# EAGLE design FluxamasynthFeather (EAGLE 8.4.1)
ABBREV: Flux3; AUTHOR: Nadya B.; PROJECT: Fluxamasynth 3
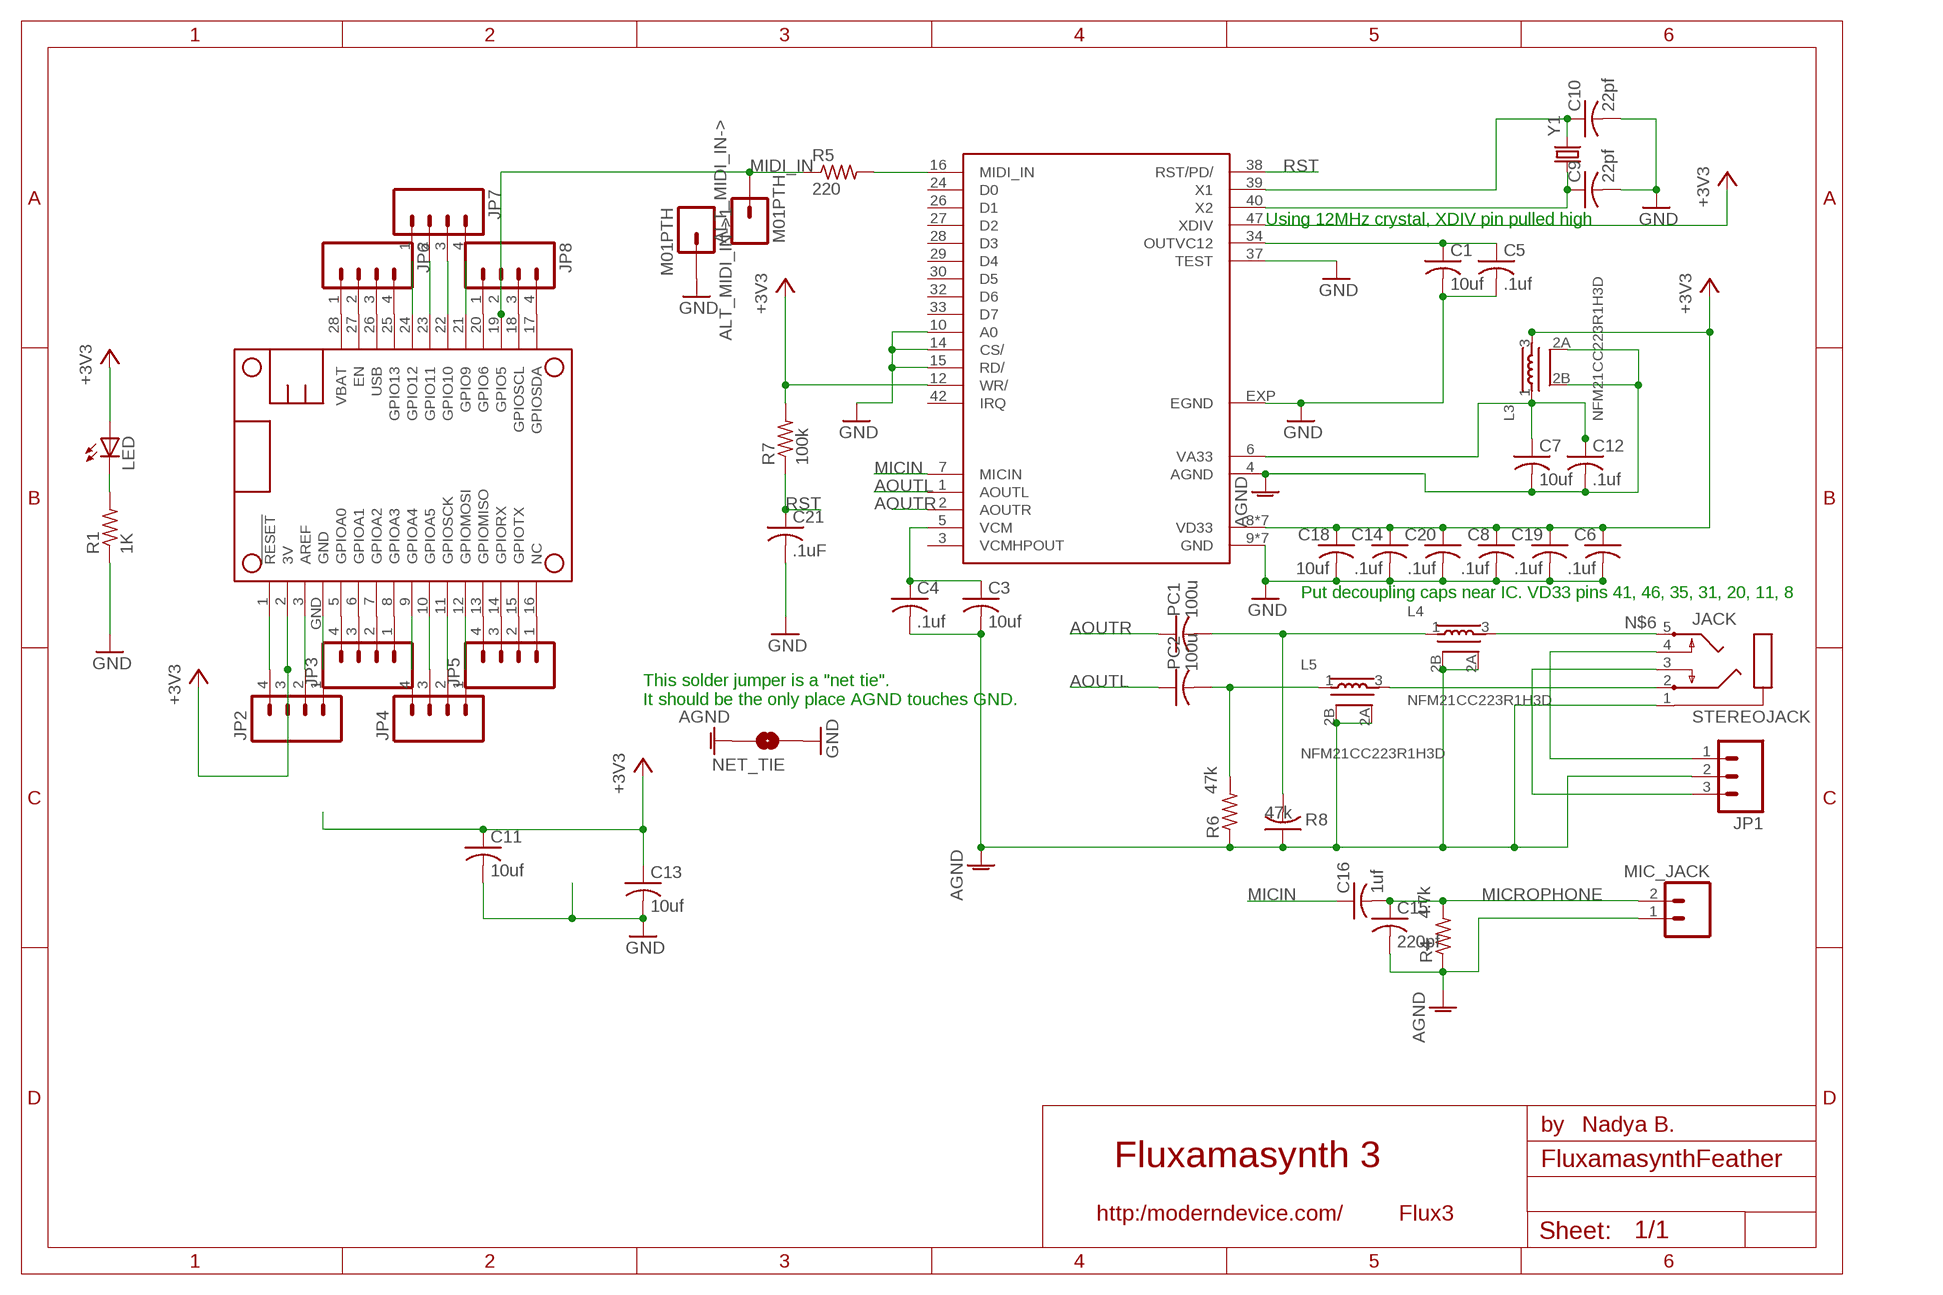
[diagram p0: schematic, sheet 1]

## Parts
ALT_MIDI_IN->  M01PTH  [1X01]
ALT_MIDI_IN->1  M01PTH  [1X01]
C1  10uf  C-USC0805K  [C0805K]
C3  10uf  C-USC0805K  [C0805K]
C4  .1uf  C-USC0603K  [C0603K]
C5  .1uf  C-USC0603K  [C0603K]
C6  .1uf  C-USC0603K  [C0603K]
C7  10uf  C-USC0805K  [C0805K]
C8  .1uf  C-USC0603K  [C0603K]
C9  22pf  C-USC0603  [C0603]
C10  22pf  C-USC0603  [C0603]
C11  10uf  C-USC0805K  [C0805K]
C12  .1uf  C-USC0603K  [C0603K]
C13  10uf  C-USC0805K  [C0805K]
C14  .1uf  C-USC0603K  [C0603K]
C15  220pf  C-USC0805K  [C0805K]
C16  1uf  C-USC0603K  [C0603K]
C18  10uf  C-USC0603K  [C0603K]
C19  .1uf  C-USC0603K  [C0603K]
C20  .1uf  C-USC0603K  [C0603K]
C21  .1uF  C-USC0603K  [C0603K]
JACK  STEREOJACK  [STX3100]
JP1  M03PTH  [1X03]
JP2  M041X04_NO_SILK  [1X04_NO_SILK]
JP3  M041X04_NO_SILK  [1X04_NO_SILK]
JP4  M041X04_NO_SILK  [1X04_NO_SILK]
JP5  M041X04_NO_SILK  [1X04_NO_SILK]
JP6  M041X04_NO_SILK  [1X04_NO_SILK]
JP7  M041X04_NO_SILK  [1X04_NO_SILK]
JP8  M041X04_NO_SILK  [1X04_NO_SILK]
L3  NFM21CC223R1H3D  [3PC]
L4  NFM21CC223R1H3D  [3PC]
L5  NFM21CC223R1H3D  [3PC]
LED  LED0603  [LED-0603]
MIC_JACK  M02PTH  [1X02]
MS1  FEATHERWING  [FEATHERWING]
NET_TIE  MODERNDEVICE_SOLDERJUMPERTRACE  [MODERNDEVICE_SJ_2S-TRACE]
PC1  100u  C-USC1206K  [C1206K]
PC2  100u  C-USC1206K  [C1206K]
R1  1K  R-US_R0603  [R0603]
R4  4.7k  R-US_R0603  [R0603]
R5  220  R-US_R0603  [R0603]
R6  47k  R-US_R0603  [R0603]
R7  100k  R-US_R0603  [R0603]
R8  47k  C-USC0603K  [C0603K]
SAM2695  SAM2695  [QFN48]
Y1  CRYSTALTXC-7A  [CRYSTAL-TXC-7A]

## Nets
+3V3 [VCC]: C6.1 C8.1 C11.1 C13.1 C14.1 C18.1 C19.1 C20.1 JP2.3 L3.3 LED.A MS1.2(3V) R7.2 SAM2695.8(VD33) SAM2695.11(VD33) SAM2695.12(WR/) SAM2695.20(VD33) SAM2695.31(VD33) SAM2695.35(VD33) SAM2695.41(VD33) SAM2695.46(VD33) SAM2695.47(XDIV)
AGND [GND]: C3.2 C4.2 C7.2 C12.2 C15.2 JACK.1 JP1.2 L3.2A L3.2B L4.2A L4.2B L5.2A L5.2B MIC_JACK.1 NET_TIE.2 R4.1 R6.1 R8.1 SAM2695.4(AGND)
AOUTL: PC2.1 SAM2695.1(AOUTL)
AOUTR: PC1.1 SAM2695.2(AOUTR)
GND [GND]: ALT_MIDI_IN->1.1 C1.2 C5.2 C6.2 C8.2 C9.2 C10.2 C11.2 C13.2 C14.2 C18.2 C19.2 C20.2 C21.2 NET_TIE.1 R1.1 SAM2695.9(GND) SAM2695.10(A0) SAM2695.13(GND) SAM2695.14(CS/) SAM2695.15(RD/) SAM2695.18(GND) SAM2695.25(GND) SAM2695.36(GND) SAM2695.37(TEST) SAM2695.45(GND) SAM2695.48(GND) SAM2695.EXP(EGND)
MICIN: C16.1 SAM2695.7(MICIN)
MICROPHONE: C15.1 C16.2 MIC_JACK.2 R4.2
MIDI_IN: ALT_MIDI_IN->.1 JP8.2 MS1.19(GPIO5) R5.1
N$1: JP2.1 MS1.GND
N$2: JP2.2 MS1.3(AREF)
N$3: JP2.4 MS1.1(!RESET)
N$4: JP3.1 MS1.8(GPIOA3)
N$5: L5.1 PC2.2 R6.2
N$6: JACK.5 L4.3
N$7: JP3.2 MS1.7(GPIOA2)
N$8: JP3.3 MS1.6(GPIOA1)
N$9: LED.C R1.2
N$10: JP3.4 MS1.5(GPIOA0)
N$11: JP4.1 MS1.12(GPIOMOSI)
N$12: R5.2 SAM2695.16(MIDI_IN)
N$13: JP4.2 MS1.11(GPIOSCK)
N$14: JP4.3 MS1.10(GPIOA5)
N$15: JP4.4 MS1.9(GPIOA4)
N$16: JP5.1 MS1.16(NC)
N$17: JP5.2 MS1.15(GPIOTX)
N$18: JP5.3 MS1.14(GPIORX)
N$19: JP5.4 MS1.13(GPIOMISO)
N$20: JP6.2 MS1.27(EN)
N$21: JACK.4 JP1.1
N$22: JP6.4 MS1.25(GPIO13)
N$23: JP7.1 MS1.24(GPIO12)
N$24: JACK.3 JP1.3
N$25: JP7.2 MS1.23(GPIO11)
N$26: JP7.3 MS1.22(GPIO10)
N$27: JP7.4 MS1.21(GPIO9)
N$28: JP8.1 MS1.20(GPIO6)
N$29: JP8.3 MS1.18(GPIOSCL)
N$30: JP8.4 MS1.17(GPIOSDA)
OUT_L: JACK.2 L5.3
OUT_R: L4.1 PC1.2 R8.2
OUTVC12: C1.1 C5.1 SAM2695.34(OUTVC12)
RST: C21.1 R7.1 SAM2695.38(RST/PD/)
USB: JP6.3 MS1.26(USB)
VA33 [VCC]: C7.1 C12.1 L3.1 SAM2695.6(VA33)
VBAT: JP6.1 MS1.28(VBAT)
VCM: C3.1 C4.1 SAM2695.5(VCM)
XTL1: C10.1 SAM2695.39(X1) Y1.P$2
XTL2: C9.1 SAM2695.40(X2) Y1.P$1
Unconnected: SAM2695.3(VCMHPOUT) SAM2695.24(D0) SAM2695.26(D1) SAM2695.27(D2) SAM2695.28(D3) SAM2695.29(D4) SAM2695.30(D5) SAM2695.32(D6) SAM2695.33(D7) SAM2695.42(IRQ)

## Notes on the sheet
- Using 12MHz crystal, XDIV pin pulled high
- Put decoupling caps near IC. VD33 pins 41, 46, 35, 31, 20, 11, 8
- This solder jumper is a "net tie".
  It should be the only place AGND touches GND.

## Library data of the parts
ALT_MIDI_IN-> ALT_MIDI_IN->1 = ModernDevice:M01: Header 1 Standard 1-pin 0.1" header. Use with straight break away headers (SKU : PRT-00116), right angle break away headers (PRT-00553), swiss pins (PRT-00743), machine pins (PRT-00117), and female headers (PRT-00115).
C1 C3-C16 C18-C21 PC1 PC2 R8 = ModernDevice:C-US: CAPACITOR, American symbol
JACK = ModernDevice:STEREOJACK: MIC/HEADPHONE JACK Stereo jack with two switches. Kycon STX3100, CUI SJ1-3555NG and/or 4UCon 05544
JP1 = ModernDevice:M03: Header 3 Standard 3-pin 0.1" header. Use with straight break away headers (SKU : PRT-00116), right angle break away headers (PRT-00553), swiss pins (PRT-00743), machine pins (PRT-00117), and female headers (PRT-00115). Molex polarized connector foot print use with SKU : PRT-08232 with associated crimp pins and housings.
JP2-JP8 = ModernDevice:M04: Header 4 Standard 4-pin 0.1" header. Use with straight break away headers (SKU : PRT-00116), right angle break away headers (PRT-00553), swiss pins (PRT-00743), machine pins (PRT-00117), and female headers (PRT-00115). Molex polarized connector foot print use with SKU : PRT-08231 with associated crimp pins and housings.
L3-L5 = ModernDevice:NFM21CC223R1H3D: CAPACITOR-TYPE NOISE SUPPRESSION FILTER digikey #NFM21CC223R1H3D
LED = ModernDevice:LED: LEDs Standard schematic elements and footprints for 5mm, 3mm, 1206, and 0603 sized LEDs. 5mm - Spark Fun Electronics SKU : COM-00529 (and others)
MIC_JACK = ModernDevice:M02: Header 2 Standard 2-pin 0.1" header. Use with straight break away headers (SKU : PRT-00116), right angle break away headers (PRT-00553), swiss pins (PRT-00743), machine pins (PRT-00117), and female headers (PRT-00115). Molex polarized connector foot print use with SKU : PRT-08233 with associated crimp pins and housings.
MS1 = adafruit:FEATHERWING
NET_TIE = BBLeo_v2:MODERNDEVICE_SOLDERJUMPER: Solder Jumper Standard SMD solder jumper. Used to automate production. Two varients : Normally Open and Normally Closed are the same, but have different paste layers. NC will have a large amount of paste and should jumper during reflow.
R1 R4-R7 = ModernDevice:R-US_: RESISTOR, American symbol
SAM2695 = ModernDevice:SAM2695
Y1 = SparkFun-FreqCtrl:CRYSTAL: Various standard crystals. Proven footprints. Spark Fun Electronics SKU : COM-00534

## Net classes
0 default: width 0.152 mm, drill 0.152 mm, clearance 0.152 mm
1 GND: width 0.152 mm, drill 0.152 mm, clearance 0.152 mm
2 VCC: width 0.152 mm, drill 0.152 mm, clearance 0.152 mm
3 VBUS: width 0.152 mm, drill 0.152 mm, clearance 0.152 mm

## Board
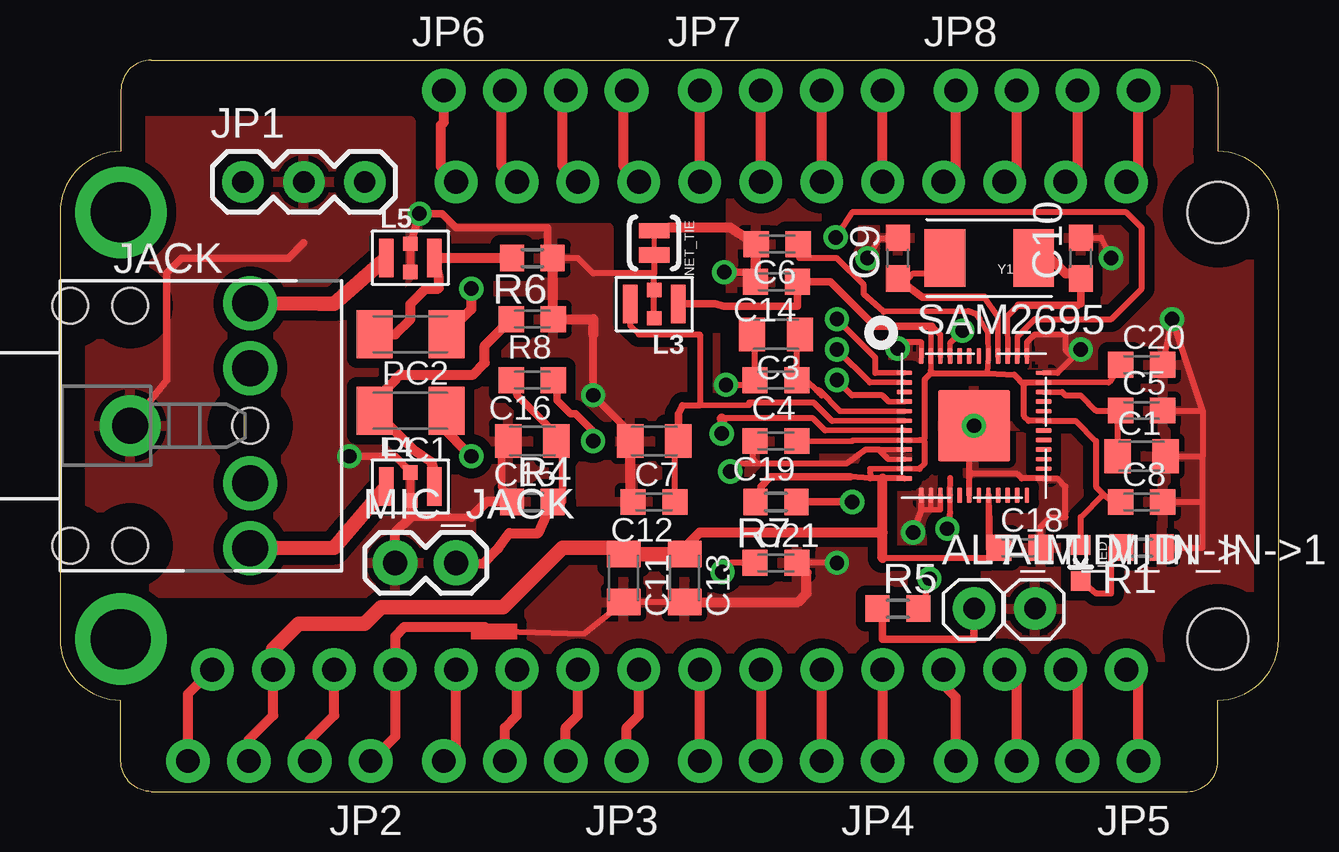
[diagram p1: board, top side]
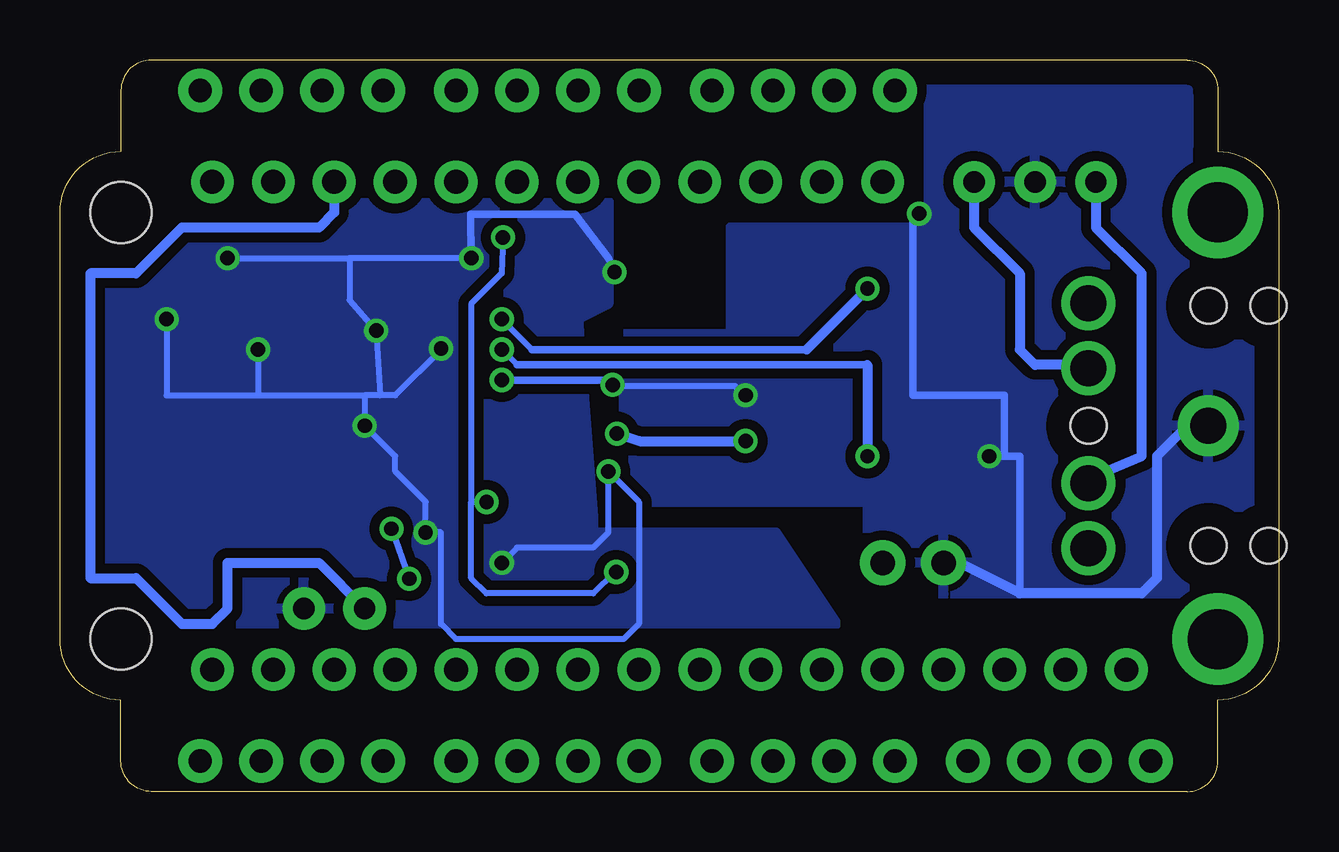
[diagram p2: board, bottom side, seen from below]

Size 50.8 x 30.48 mm. Coordinates in mm from the lower left corner, seen from the top.
Copper layers (1*16): Top 0.035mm / dielectric 1.5mm / Bottom 0.035mm
Design rules "default *": minimum track width 6mil, minimum drill 0.35mm, track to track 6mil, track to pad 6mil, pad to pad 6mil, via to via 6mil, smd to smd 6mil, copper to edge 40mil, drill to drill 6mil, minimum pad ring 10mil, minimum via ring 8mil, stop-mask expansion 4mil, vias tented up to drill 25mil, thermal gap 10mil

### Footprints (pad centres in the part's own frame; a part is rotated, then mirrored left to right if it is on the bottom)
1X01 = drill 0.889 pad 1.778: 1 0,0
C0805K = smd 1.1 x 1.4: 1 -1,0; 2 1,0
C0603K = smd 1.05 x 1.08: 1 -0.875,0; 2 0.875,0
C0603 = smd 1.1 x 1: 1 -0.85,0; 2 0.85,0
STX3100 = drill 1.5 pad 2.54: 1 2.929,0.002 | drill 1.5: 2 7.929,5.102; 3 7.929,2.402; 4 7.929,-2.398; 5 7.929,-5.098 | hole 1.5: 2.929,5.002; 2.929,-4.998; 7.929,0.002; 0.429,5.002; 0.429,-4.998
1X03 = drill 0.889 pad 1.727: 1 0,0; 2 2.54,0; 3 5.08,0
1X04_NO_SILK = drill 0.965 pad 1.829: 1 0,0; 2 2.54,0; 3 5.08,0; 4 7.62,0
3PC = smd 0.6 x 1.6: 1 0.998,0.013; 3 -1,0.01 | smd 0.6 x 0.6: 2A 0,-0.58; 2B 0,0.6
LED-0603 = smd 0.8 x 0.8: A 0,-0.75; C 0,0.75
1X02 = drill 1.016 pad 1.88: 1 0,0; 2 2.54,0
FEATHERWING = drill 1 pad 1.778: 1 6.35,1.27; 2 8.89,1.27; 3 11.43,1.27; 5 16.51,1.27; 6 19.05,1.27; 7 21.59,1.27; 8 24.13,1.27; 9 26.67,1.27; 10 29.21,1.27; 11 31.75,1.27; 12 34.29,1.27; 13 36.83,1.27; 14 39.37,1.27; 15 41.91,1.27; 16 44.45,1.27; 17 44.45,21.59; 18 41.91,21.59; 19 39.37,21.59; 20 36.83,21.59; 21 34.29,21.59; 22 31.75,21.59; 23 29.21,21.59; 24 26.67,21.59; 25 24.13,21.59; 26 21.59,21.59; 27 19.05,21.59; 28 16.51,21.59; GND 13.97,1.27 | drill 2.5 pad 3.81: P$1 2.54,20.32; P$2 2.54,2.54 | hole 2.54: 48.26,20.32; 48.26,2.54
MODERNDEVICE_SJ_2S-TRACE = smd 0.635 x 1.27: 1 -0.508,0; 2 0.508,0
C1206K = smd 1.5 x 2: 1 -1.5,0; 2 1.5,0
R0603 = smd 1 x 1.1: 1 -0.85,0; 2 0.85,0
QFN48 = smd 0.65 x 0.2: 1 -2.9,2.206; 2 -2.9,1.806; 3 -2.9,1.406; 4 -2.9,1.006; 5 -2.9,0.606; 6 -2.9,0.206; 7 -2.9,-0.194; 8 -2.9,-0.594; 9 -2.9,-0.994; 10 -2.9,-1.394; 11 -2.9,-1.794; 12 -2.9,-2.194; 25 2.9,-2.194; 26 2.9,-1.794; 27 2.9,-1.394; 28 2.9,-0.994; 29 2.9,-0.594; 30 2.9,-0.194; 31 2.9,0.206; 32 2.9,0.606; 33 2.9,1.006; 34 2.9,1.406; 35 2.9,1.806; 36 2.9,2.206 | smd 0.2 x 0.65: 13 -2.2,-2.894; 14 -1.8,-2.894; 15 -1.4,-2.894; 16 -1,-2.894; 17 -0.6,-2.894; 18 -0.2,-2.894; 19 0.2,-2.894; 20 0.6,-2.894; 21 1,-2.894; 22 1.4,-2.894; 23 1.8,-2.894; 24 2.2,-2.894; 37 2.2,2.906; 38 1.8,2.906; 39 1.4,2.906; 40 1,2.906; 41 0.6,2.906; 42 0.2,2.906; 43 -0.2,2.906; 44 -0.6,2.906; 45 -1,2.906; 46 -1.4,2.906; 47 -1.8,2.906; 48 -2.2,2.906 | smd 3 x 3: EXP 0,0
CRYSTAL-TXC-7A = smd 1.7 x 2.4: P$1 1.85,0; P$2 -1.85,0

### Placement (x,y rotation side)
ALT_MIDI_IN->  38.1,7.62 0 top
ALT_MIDI_IN->1  40.64,7.62 0 top
C1  45.08,13.97 0 top
C3  29.84,19.05 180 top
C4  29.84,17.14 180 top
C5  45.08,15.88 0 top
C6  29.9,22.81 180 top
C7  24.77,14.61 180 top
C8  45.08,12.07 0 top
C9  34.92,22.22 90 top
C10  42.54,22.22 90 top
C11  23.5,8.89 270 top
C12  24.77,12.07 180 top
C13  26.04,8.89 270 top
C14  29.87,21.23 180 top
C15  19.68,14.61 180 top
C16  19.68,17.14 180 top
C18  40,10.16 0 top
C19  29.84,14.61 180 top
C20  45.08,17.78 0 top
C21  29.84,9.53 0 top
JACK  0,15.24 0 top
JP1  7.62,25.4 0 top
JP2  12.95,1.27 180 top
JP3  23.62,1.27 180 top
JP4  34.29,1.27 180 top
JP5  44.96,1.27 180 top
JP6  16,29.21 0 top
JP7  26.67,29.21 0 top
JP8  37.34,29.21 0 top
L3  24.77,20.32 180 top
L4  14.61,12.7 0 top
L5  14.61,22.22 0 top
LED  42.54,9.53 180 top
MIC_JACK  13.97,9.53 0 top
MS1  0,3.81 0 top
NET_TIE  24.77,22.86 270 top
PC1  14.61,15.88 180 top
PC2  14.61,19.05 180 top
R1  45.08,10.16 180 top
R4  19.68,12.07 0 top
R5  34.92,7.62 0 top
R6  19.68,22.22 180 top
R7  29.84,12.07 180 top
R8  19.68,19.68 180 top
SAM2695  38.1,15.24 0 top
Y1  38.73,22.22 180 top

### Tracks (layer width: path | path; a pad name or v marks a point on that pad's centre or on a via)
+3V3
  Top 0.229: SAM2695.35 43.72,17.05 | 36.3,17.55 SAM2695.47 36.3,19.27 | 38.66,17.42 SAM2695.41 38.68,19.05 38.68,19.1 38.33,19.71 | 33.77,13.45 SAM2695.11 35.82,13.45 | C19.1 33.02,14.61 33.06,14.65 SAM2695.8 35.83,14.65 35.84,14.66 35.94,14.66 | SAM2695.46 36.7,19.03 36.35,19.38
  Top 0.254: 43.72,17.05 43.81,17.14 C20.1 | 43.5,12.38 43.18,12.7 43.18,14.61 42.34,15.45 SAM2695.31 40.38,15.45 40.18,15.65 40.18,16.94 40.08,17.04 | 43.5,12.38 43.81,12.07 C8.1 | 40.08,17.04 40,17.12 40,17.14 39.78,17.37 38.66,17.42 36.3,17.42 | 40.08,17.04 SAM2695.35 | 36.3,17.55 36.3,17.42 | LED.A 42.54,11.43 43.5,12.38 | C18.1 38.73,10.56 38.73,11.43 38.71,11.53 SAM2695.20 38.7,10.2 38.73,9.73 34.29,9.73 | 33.77,13.45 33.77,13.05 | 33.77,13.05 32.94,13.11 | SAM2695.12 34.29,13.05 33.77,13.05 | 35.82,13.45 36.04,13.67 36.04,14.55 35.94,14.66 35.97,14.66 36.04,14.73 36.04,17.17 36.3,17.42 | 38.33,19.71 38.2,19.89 37.85,20.02 34.34,19.99 33.5,20.73 33.5,21.11 32.38,22.22 30.82,22.22 C6.1 | 36.3,19.27 36.2,19.38
  Top 0.305: 36.35,19.38 36.2,19.38 33.96,19.38 32.11,21.23 C14.1 30.73,20.22 27.69,20.22 27.3,20.32 26.04,20.32 L3.3 | 32.94,13.11 29.62,13.11 29.21,12.7 29.21,12.28 R7.2
  Top 0.406: 34.29,9.73 34.29,10.79 | 34.29,10.79 34.29,13.05 | C13.1 26.04,10.16 26.67,10.79 34.29,10.79 | JP2.3 7.87,2.16 8.89,3.18 MS1.2
  Top 0.61: MS1.2 8.89,5.92 9.96,6.99 12.7,6.99 13.39,7.67 18.47,7.67 20.96,10.16 23.23,10.16 C11.1 C13.1
AGND  (via drill 0.6)
  Top 0.229: SAM2695.4 34.55,16.25
  Top 0.254: 34.55,16.25 34.29,16.51 33.02,16.51 v32.38,17.14 | C3.2 28.97,18.92 C4.2 28.77,16.94 v27.76,16.94 | L3.2B L3.2A 24.77,21.59 | NET_TIE.2 24.77,21.59 | 24.77,21.59 22.23,21.59 21.59,22.22 R6.1
  Top 0.305: v12.07,13.97 13.97,13.97 L4.2B L4.2A 14.61,11.43 17.14,11.43 | L5.2A L5.2B v14.99,24.08 15.93,24.08 16.51,23.49 20.32,23.49 20.32,22.44 R6.1 | 22.23,19.05 v22.23,16.51 23.5,15.24 23.5,14.88 C7.2 | 10.16,22.86 9.53,22.22 5.08,22.22 4.45,21.59 4.45,17.14 JACK.1 | R4.1 18.41,12.7 18.41,13.97 C15.2
  Top 0.406: C7.2 23.77,12.19 C12.2 | 22.23,19.05 22.23,19.68 R8.1 20.56,22.2 R6.1 | R4.1 17.78,12.07 17.14,11.43 | MIC_JACK.1 13.97,10.79 14.61,11.43 | 10.16,24.77 JP1.2
  Bottom 0.254: 27.94,17.14 27.94,17.12 | v22.23,16.51 22.28,16.51 22.66,16.89 27.71,16.89
  Bottom 0.305: v12.07,13.97 11.43,13.97 | 11.43,13.97 10.79,13.97 10.79,8.26 | 11.43,13.97 11.43,16.51 15.24,16.51 15.24,23.82 v14.99,24.08 | v32.38,17.14 27.94,17.14 | 27.94,17.12 v27.76,16.94 27.71,16.89
  Bottom 0.406: JACK.1 3.81,15.24 5.08,13.97 5.08,8.89 5.71,8.26 10.79,8.26 13.34,9.53 MIC_JACK.1
  pour Top (isolate 0.406): -2.54,8.26 -3.17,27.94 14.61,27.94 14.61,23.49 22.86,23.49 22.86,19.05 27.3,19.05 27.3,12.07 17.14,12.07 17.14,8.26
  pour Bottom (isolate 0.406): -2.54,8.26 -3.17,29.84 14.61,29.84 14.61,23.49 22.86,23.49 22.86,19.05 27.3,19.05 27.3,12.07 17.14,12.07 17.14,8.26
AOUTL  (via drill 0.6)
  Top 0.229: SAM2695.1 33.99,17.45
  Top 0.254: 33.99,17.45 33.99,18.08 v32.38,19.68
  Top 0.406: v17.14,20.95 17.14,20.09 PC2.1
  Bottom 0.254: v32.38,19.68 31.11,18.41
  Bottom 0.305: 31.11,18.41 19.68,18.41
  Bottom 0.406: 19.68,18.41 v17.14,20.95
AOUTR  (via drill 0.6)
  Top 0.229: SAM2695.2 33.75,17.05
  Top 0.254: 33.75,17.05 v32.38,18.41
  Top 0.406: v17.14,13.97 15.88,15.24 15.88,15.65 PC1.1
  Bottom 0.254: v32.38,18.41 31.75,17.78
  Bottom 0.305: 31.75,17.78 17.14,17.78
  Bottom 0.406: 17.14,17.78 v17.14,13.97
GND  (via drill 0.6)
  Top 0.229: SAM2695.36 41.58,17.45 | SAM2695.37 40.3,18.71 40.64,19.05 | 35.89,11.74 36.3,11.74 | 36.3,11.74 36.7,11.74 SAM2695.15 | SAM2695.14 36.3,11.74 | SAM2695.9 34.14,14.25 | SAM2695.10 34.54,13.85 | SAM2695.45 37.1,18.68 | SAM2695.48 35.9,18.71 | SAM2695.13 35.9,11.77
  Top 0.254: C1.2 47.62,13.97 | C20.2 v46.35,19.68 47.62,15.88 | 47.62,15.88 47.62,13.97 | C8.2 47.62,12.07 | 47.62,12.07 47.62,13.97 | 41.58,17.45 42.23,18.1 | 40.64,19.05 41.91,19.05 41.91,18.41 42.23,18.1 | SAM2695.13 35.89,11.74 | 29.06,13.67 32.79,13.67 33.57,14.25 34.14,14.25 34.54,13.85 | 29.06,13.67 28.88,13.87 28.88,14.52 C19.2 | SAM2695.18 37.9,13.34 | 37.9,13.34 37.9,15.04 | 37.9,13.34 38,13.23 39.9,13.23 40.09,13.05 SAM2695.25 41.56,13.05 41.91,12.7 41.91,11.43 41.27,11.43 40.88,11.04 C18.2 | 35.9,18.71 35.17,18.71 v34.91,18.46 | 37.1,18.68 v37.62,19.2 | 34.92,23.02 34.12,23.02 v33.65,22.22 | C10.2 43.39,23.07 v43.81,22.22 | 42.23,18.1 v42.54,18.41 | R1.1 47.62,10.16 47.62,12.07 | C5.2 47.62,15.88 | 35.9,11.77 v35.56,10.79 | 29.06,13.67 28.27,13.67 v27.94,13.34 | v32.38,9.53 C21.2 | 18.42,6.68 21.85,6.58 C11.2 C13.2
  Top 0.305: C14.2 29.02,21.64 v27.69,21.64
  Top 0.406: 34.92,23.02 C9.2 | C13.2 30.75,7.89 31.11,8.26 31.11,9.13 C21.2 | 29.02,21.64 C6.2 27.94,23.49 25.4,23.49 NET_TIE.1 | 18.27,6.68 18.42,6.68
  Bottom 0.254: v46.35,19.68 46.35,16.51 42.54,16.51 | 42.54,16.51 38.1,16.51 | 38.1,16.51 SAM2695.EXP 36.83,13.97 36.83,13.34 35.56,12.07 v35.56,10.79 34.92,10.79 34.92,6.99 34.29,6.35 27.3,6.35 26.67,6.99 26.67,12.07 v27.94,13.34 27.94,10.79 28.57,10.16 31.75,10.16 v32.38,9.53 | v34.91,18.46 34.97,18.46 34.92,18.41 36.83,16.51 37.46,16.51 | 37.46,16.51 38.1,16.51 | 37.46,16.51 v37.62,19.2 38.73,20.47 38.73,22.22 | v43.81,22.22 38.73,22.22 | v33.65,22.22 38.73,22.22 | v42.54,18.41 42.54,16.51
  Bottom 0.305: v27.69,21.64 27.94,22.22 29.34,24.05 33.68,24.05 v33.65,22.22
  other vias: 38.1,15.24
  pour Bottom (isolate 0.406): 27.94,28.57 27.94,20.32 29.21,19.68 28.57,11.43 28.57,10.79 20.96,10.79 18.41,6.99 51.43,6.99 52.07,28.57
  pour Top (isolate 0.406): 27.94,29.84 27.94,20.32 29.21,19.68 28.57,11.43 28.57,10.79 20.96,10.79 17.14,5.08 52.7,5.71 52.7,29.84
MICIN  (via drill 0.6)
  Top 0.229: SAM2695.7 31.89,15.05
  Top 0.254: 31.89,15.05 31.39,15.54 27.58,15.54
  Top 0.305: v22.23,14.61 22.23,15.01 21.49,15.75 21.29,15.75 20.73,16.31 20.73,16.98 C16.1
  Top 0.406: 27.58,15.54 v27.58,14.91 | 20.32,16.9 C16.1
  Bottom 0.406: v27.58,14.91 26.64,14.61 v22.23,14.61
MICROPHONE
  Top 0.305: R4.2 20.96,12.07 20.96,13.97 C15.1 20.32,15.24 19.05,16.51 C16.2
  Top 0.406: MIC_JACK.2 17.63,9.5 18.26,10.13 18.72,10.77 19.94,10.77 R4.2
MIDI_IN
  Top 0.305: ALT_MIDI_IN->.1 38.1,6.35 34.29,6.35 34.29,7.41 R5.1
  Top 0.406: MS1.19 39.88,25.91 JP8.2
  Bottom 0.406: MS1.19 39.37,24.13 40,23.49 45.72,23.49 47.62,21.59 49.53,21.59 49.53,8.89 47.62,8.89 45.72,6.99 44.45,6.99 43.81,7.62 43.81,9.53 40,9.53 ALT_MIDI_IN->.1
N$1
  Top 0.406: JP2.1 13.97,2.29 MS1.GND 13.97,6.48 14.35,6.86 17.71,6.86
N$2
  Top 0.406: JP2.2 10.41,2.16 11.43,3.18 MS1.3 | MS1.3 11.43,5.71 MS1.3
N$3
  Top 0.406: JP2.4 5.33,4.06 MS1.1
N$4
  Top 0.406: JP3.1 23.62,2.67 24.13,3.18 MS1.8
N$5
  Top 0.406: PC2.2 13.97,19.05 14.61,19.68 14.61,20.32 15.24,20.95 15.77,20.95 15.8,20.98 15.8,21.41 L5.1 15.62,22.22 R6.2
N$6
  Top 0.61: JACK.5 11.43,10.16 L4.3
N$7
  Top 0.406: JP3.2 21.08,2.67 21.59,3.18 MS1.7
N$8
  Top 0.406: JP3.3 18.54,2.67 19.05,3.18 MS1.6
N$9
  Top 0.254: LED.C 43.18,8.26 43.81,8.26 43.81,10.16 R1.2
N$10
  Top 0.406: JP3.4 16.51,1.78 MS1.5
N$11
  Top 0.406: MS1.12 JP4.1
N$12  (via drill 0.6)
  Top 0.229: SAM2695.16 37.1,11.64
  Top 0.254: SAM2695.16 37.11,13.06 | 37.1,11.64 v36.98,10.95 | v36.25,8.87 35.99,7.84 R5.2
  Bottom 0.254: v36.98,10.95 v36.25,8.87
N$13
  Top 0.406: JP4.2 MS1.11
N$14
  Top 0.406: MS1.10 JP4.3 | JP4.3 29.16,1.22 JP4.3
N$15
  Top 0.406: JP4.4 MS1.9
N$16
  Top 0.406: JP5.1 44.96,4.57 MS1.16
N$17
  Top 0.406: JP5.2 42.42,4.57 MS1.15
N$18
  Top 0.406: JP5.3 39.88,4.57 MS1.14
N$19
  Top 0.406: JP5.4 37.34,3.94 36.83,4.45 MS1.13
N$20
  Top 0.406: 19.05,25.45 MS1.27 18.41,26.04 18.41,29.08 JP6.2
N$21
  Bottom 0.406: JACK.4 7.93,13.03 5.71,13.97 5.71,21.59 7.62,23.49 JP1.1
N$22
  Top 0.406: MS1.25 23.5,26.04 23.5,29.08 JP6.4
N$23
  Top 0.406: MS1.24 JP7.1
N$24
  Bottom 0.406: JACK.3 8.26,17.78 10.16,17.78 10.79,18.41 10.79,21.59 12.7,23.49 JP1.3
N$25
  Top 0.406: MS1.23 JP7.2
N$26
  Top 0.406: MS1.22 JP7.3
N$27
  Top 0.406: MS1.21 JP7.4
N$28
  Top 0.406: MS1.20 37.34,25.91 JP8.1
N$29
  Top 0.406: MS1.18 42.42,25.91 JP8.3
N$30
  Top 0.406: MS1.17 44.96,25.91 JP8.4
OUT_L
  Top 0.61: JACK.2 10.79,20.32 11.43,20.32 L5.3
OUT_R
  Top 0.406: L4.1 15.6,13.33 15.49,13.72 14.76,14.22 PC1.2 13.34,15.88 13.34,16.51 13.97,17.14 13.97,17.17 14.17,17.37 17.22,17.37 17.7,17.86 17.7,18.58 R8.2
OUTVC12
  Top 0.229: SAM2695.34 41.77,16.65
  Top 0.254: 41.77,16.65 41.91,16.51 42.54,16.51 43.18,15.88 C5.1 44.08,15.75 C1.1
RST  (via drill 0.6)
  Top 0.229: SAM2695.38 39.9,18.95 40.64,19.68
  Top 0.254: 40.64,19.68 43.81,19.68 45.08,20.95 45.08,23.49 44.45,24.13 33.02,24.13 v32.33,23.09 | C21.1 27.94,9.53 27.94,9.47 v27.61,9.14
  Top 0.305: v33.02,12.07 R7.1
  Top 0.406: C21.1 28.57,9.53
  Bottom 0.254: v32.33,23.09 32.38,21.59 33.65,20.32 33.65,12.07 | 33.65,12.07 v33.02,12.07 | v27.61,9.14 27.69,9.14 28.57,8.26 33.02,8.26 33.65,8.89 33.65,12.07
USB
  Top 0.406: MS1.26 20.96,26.04 20.96,29.26 21.03,29.26 JP6.3
VA33
  Top 0.229: SAM2695.6 32.18,15.45
  Top 0.254: 32.18,15.45 31.42,16.2 28.73,16.2 28.73,16.1 26.67,16.08 | 26.67,16.08 25.95,16.08 | C12.1 25.64,14.48 C7.1 | L3.1 23.77,19.41 24.13,19.05 26.67,19.05 26.67,16.08
  Top 0.305: 25.95,16.08 25.78,15.75 C7.1
VBAT
  Top 0.406: JP6.1 16,27.89 15.88,27.76 15.88,26.04 MS1.28
VCM
  Top 0.229: SAM2695.5 32.52,15.85
  Top 0.254: 32.52,15.85 31.65,16.71 | 31.65,16.71 31.55,16.71 31.11,17.14 C4.1 30.72,18.92 C3.1 | 31.65,16.71 31.65,16.61 31.75,16.51
XTL1
  Top 0.229: SAM2695.39 39.5,19.81
  Top 0.254: 39.5,19.81 39.95,20.27
  Top 0.305: 39.95,20.27 42.42,20.27 42.54,20.32 C10.1
  Top 0.406: Y1.P$2 41.27,22.22 41.91,21.59 42.33,21.59 C10.1
XTL2
  Top 0.229: SAM2695.40 39.09,19.81
  Top 0.254: 39.09,19.81 38.53,20.6 | C9.1 35.34,21.38 35.56,21.59 36.62,21.59 36.97,21.23
  Top 0.305: C9.1 35.94,20.6 38.53,20.6
  Top 0.406: Y1.P$1 36.62,22.22 36.62,21.59
(copper drawn outside any net)
  shapes: Top area x1